# Altium project main_io.PrjPcb (part 4 of 6)

## Sheet RTC.SchDoc
size A4; Organization: Badgerloop; Address1: 133 Engineering Research; Address2: Building; Address3: Madison, WI 53715
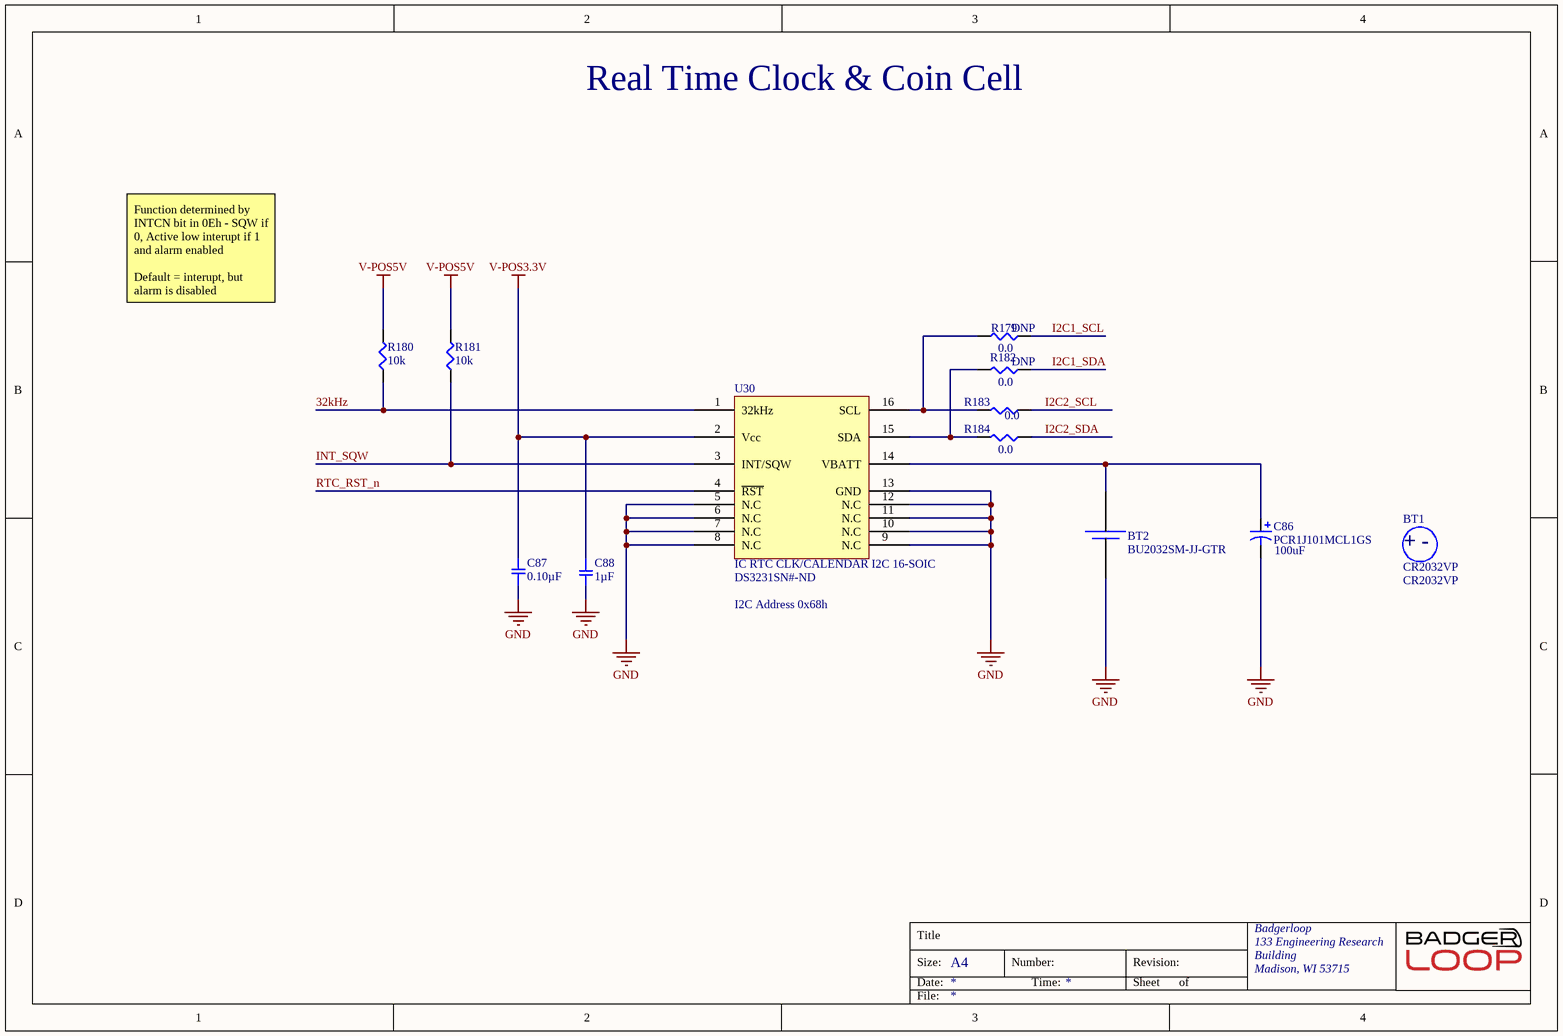
[diagram p11: RTC.SchDoc]

### Parts
BT1  CR2032VP  (mechanical)
BT2  BU2032SM-JJ-GTR  [BATTERY HOLDER COIN 20MM]
C86  PCR1J101MCL1GS  Capacitance: 100uF  [CAPAE110103X126M]
C87  0.10µF  [SMD-0805C]
C88  1µF  [SMD-0805C]
R179  0.0  [SMD-0805-RES]
R180  10k  [SMD-0805-RES]
R181  10k  [SMD-0805-RES]
R182  0.0  [SMD-0805-RES]
R183  0.0  [SMD-0805-RES]
R184  0.0  [SMD-0805-RES]
U30  IC RTC CLK/CALENDAR I2C 16-SOIC  Supplier Part Number 1: DS3231SN#-ND  [SOP127P1030X265-16N]

### Nets
GND: BT2.1(+) C86.2 C87.1 C88.2 U30.5(N.C) U30.6(N.C) U30.7(N.C) U30.8(N.C) U30.9(N.C) U30.10(N.C) U30.11(N.C) U30.12(N.C) U30.13(GND)
V-POS3.3V: C87.2 C88.1 U30.2(Vcc)
V-POS5V: R180.2 R181.2
32kHz: R180.1 U30.1(32kHz)
I2C1_SCL: R179.1
I2C1_SDA: R182.1
I2C2_SCL: R183.1
I2C2_SDA: R184.1
INT_SQW: R181.1 U30.3(INT/SQW)
RTC_RST_n: U30.4(~{RST})
NetBT2_2: BT2.2(-) C86.1 U30.14(VBATT)
NetR179_2: R179.2 R183.2 U30.16(SCL)
NetR182_2: R182.2 R184.2 U30.15(SDA)

### Notes on the sheet
- Real Time Clock & Coin Cell
- Function determined by INTCN bit in 0Eh - SQW if 0, Active low interupt if 1 and alarm enabled
  Default = interupt, but alarm is disabled
- I2C Address 0x68h
- Title
- Size:
- Date:
- A4
- Number:
- Time:
- Revision:
- Sheet
- of
- File:
- (in symbol CR2032VP) + -

### Library data of the parts
BT1 = CR2032VP: BATTERY LITHIUM 3V COIN 20MM; Manufacturer: Energizer; Capacity: 240mAh; Supplier 1: Newark; Stock 1: 0; Weight: 0.1oz; Voltage Rating: 3V; Package Quantity: 200; Height: 0.13inch; ComponentLink1URL: http://data.energizer.com/pdfs/cr2032.pdf?src-supplier=Digi-Key; ComponentLink1Description: http://data.energizer.com/pdfs/cr2032.pdf?src-supplier=Digi-Key; Supplier Part Number 1: 41P0336; Manufacturer Part Number: CR2032VP
BT2 = BU2032SM-JJ-GTR: HOLDER COIN CELL 2032 SMD; Manufacturer: Memory Protection Devices; Number of Cells: 1; Supplier 1: Digi-Key; Stock 1: 90564; Pricing 1: 1=0.99, 10=0.836, 100=0.6907 (USD); Mount: Surface Mount,PCB; Min Operating Temperature: -40°C; Max Operating Temperature: 280°C; Package Quantity: 400; Termination: SMD/SMT; ComponentLink1URL: http://www.memoryprotectiondevices.com/datasheets/BU2032SM-JJ-GTR-datasheet.pdf?src-supplier=Digi-Key; ComponentLink1Description: http://www.memoryprotectiondevices.com/datasheets/BU2032SM-JJ-GTR-datasheet.pdf?src-supplier=Digi-Key; ComponentLink2URL: https://media.digikey.com/pdf/Data%20Sheets/Memory%20Protection%20PDFs/Coin_Cell_Guide.pdf?src-supplier=Digi-Key; ComponentLink2Description: https://media.digikey.com/pdf/Data%20Sheets/Memory%20Protection%20PDFs/Coin_Cell_Guide.pdf?src-supplier=Digi-Key; Supplier Part Number 1: BU2032SM-JJ-GDKR-ND
C86 = PCR1J101MCL1GS: CAP ALUM POLY 100UF 20% 63V SMD; Manufacturer: Nichicon; ESR (Equivalent Series Resistance): 24mR; Ripple Current: 3A; Leakage Current: 3uA; Life (Hours): 4000Hour; Dissipation Factor: 0.08%; Supplier 1: Digi-Key; Manufacturer Part Number: PCR1J101MCL1GS; Stock 1: 11476; Pricing 1: 1=3.63000, 10=2.92800, 100=2.28380 (USD); RoHS: Yes; Mount: Surface Mount,PCB; Case/Package: Radial; Weight: 0.045856oz; Min Operating Temperature: -55°C; Max Operating Temperature: 125°C; Tolerance: 20%; Voltage Rating (DC): 63V; Package Quantity: 1; Packaging: Tape and Reel; Voltage Rating: 63V; Termination: SMD/SMT; Voltage: 63V; Diameter: 10mm; Length: 12.7mm; Height: 12.7mm; Height - Seated (Max): 0.504inch; Depth: 10.3mm; Lead Pitch: 4.6mm; Lead Free: Lead Free; ComponentLink1URL: https://datasheet.ciiva.com/29551/e-ch-ta-29551389.pdf?src-supplier=Digi-Key; ComponentLink1Description: https://datasheet.ciiva.com/29551/e-ch-ta-29551389.pdf?src-supplier=Digi-Key; ComponentLink2URL: https://datasheet.ciiva.com/29551/e-ch-ta-29551390.pdf?src-supplier=Digi-Key; ComponentLink2Description: https://datasheet.ciiva.com/29551/e-ch-ta-29551390.pdf?src-supplier=Digi-Key; ComponentLink3URL: https://datasheet.ciiva.com/29551/e-ch-ta-29551391.pdf?src-supplier=Digi-Key; ComponentLink3Description: https://datasheet.ciiva.com/29551/e-ch-ta-29551391.pdf?src-supplier=Digi-Key; Supplier Part Number 1: 493-13783-1-ND
C87 = GRM219R71C104JA01D: CAP CER 0.1UF 16V X7R 0805; Manufacturer: Murata Electronics North America; Factory Stock: 0; Unit Price (USD): 0.12; Minimum Quantity: 1; Tolerance: ±5%; Datasheets: -; Image: //media.digikey.com/Renders/Murata%20Renders/0805%20(2012%20Metric)%20.85mm.jpg; Digi-Key Part Number: 490-12557-1-ND; Part Number: GRM219R71C104JA01D; Quantity Available: 6635; @ qty: 0; Packaging: Cut Tape (CT); Series: GRM; Part Status: Active; Value: 0.10µF; Voltage: 16V; Temperature Coefficient: X7R; Operating Temperature: -55°C ~ 125°C; Features: -; Ratings: -; Applications: General Purpose; Mounting Type: Surface Mount, MLCC; Package / Case: 0805 (2012 Metric); Size / Dimension: 0.079" L x 0.049" W (2.00mm x 1.25mm); Height - Seated (Max): -; Thickness (Max): 0.037" (0.95mm); Lead Spacing: -; Lead Style: -
C88 = GRM21BR71H105KA12L: CAP CER 1UF 50V X7R 0805; Manufacturer: Murata Electronics North America; Factory Stock: 0; Unit Price (USD): 0.25; Minimum Quantity: 1; Tolerance: ±10%; Datasheets: http://www.murata.com/~/media/webrenewal/support/library/catalog/products/capacitor/mlcc/c02e.pdf; Image: //media.digikey.com/Renders/Murata%20Renders/0805%20(2012%20Metric)%20.85mm.jpg; Digi-Key Part Number: 490-4736-1-ND; Part Number: GRM21BR71H105KA12L; Quantity Available: 988032; @ qty: 0; Packaging: Cut Tape (CT); Series: GRM; Part Status: Active; Value: 1µF; Voltage: 50V; Temperature Coefficient: X7R; Operating Temperature: -55°C ~ 125°C; Features: -; Ratings: -; Applications: General Purpose; Mounting Type: Surface Mount, MLCC; Package / Case: 0805 (2012 Metric); Size / Dimension: 0.079" L x 0.049" W (2.00mm x 1.25mm); Height - Seated (Max): -; Thickness (Max): 0.053" (1.35mm); Lead Spacing: -; Lead Style: -
R179 R182-R184 = ERJ-6GEY0R00V: as R168 on sheet retros; Part Number: ERJ-6GEY0R00V; Datasheets: http://industrial.panasonic.com/www-cgi/jvcr13pz.cgi?E+PZ+3+AOA0001+ERJ6GEY0R00V+7+WW; Image: //media.digikey.com/Renders/Panasonic%20Renders/ERJ-0805%20Pkg.jpg; Digi-Key Part Number: P0.0ACT-ND; Quantity Available: 1597627; Packaging: Cut Tape (CT); Series: ERJ; Part Status: Active; Value: 0.0; Tolerance: Jumper; Composition: Thick Film; Features: Automotive AEC-Q200; Temperature Coefficient: -; Operating Temperature: -55°C ~ 155°C; Package / Case: 0805 (2012 Metric); Supplier Device Package: 0805; Size / Dimension: 0.079" L x 0.049" W (2.00mm x 1.25mm); Height - Seated (Max): 0.028" (0.70mm); Number of Terminations: 2; Failure Rate: -
  R179 R182: DNP: DNP
R180 R181 = ERJ-P06J103V: as R68 on sheet connectors; Part Number: ERJ-P06J103V; Datasheets: https://industrial.panasonic.com/cdbs/www-data/pdf/RDA0000/AOA0000C243.pdf; Image: //media.digikey.com/Renders/Panasonic%20Renders/ERJ-0805%20Pkg.jpg; Digi-Key Part Number: P10KADCT-ND; Quantity Available: 413576; Packaging: Cut Tape (CT); Series: ERJ; Part Status: Active; Value: 10k; Tolerance: ±5%; Composition: Thick Film; Features: Automotive AEC-Q200, Pulse Withstanding; Operating Temperature: -55°C ~ 155°C; Package / Case: 0805 (2012 Metric); Supplier Device Package: 0805; Size / Dimension: 0.079" L x 0.049" W (2.00mm x 1.25mm); Height - Seated (Max): 0.028" (0.70mm); Number of Terminations: 2; Failure Rate: -
U30 = DS3231: Manufacturer: Maxim; Manufacturer Part Number: DS3231SN#; Max Supply Voltage: 5.5V; Min Supply Voltage: 2.3V; Logic Function: Clock; Time Format: HH:MM:SS; Date Format: YY-MM-DD-dd; Operating Supply Voltage: 3.3V; Interface: I2C,Serial,2-Wire; Number of Outputs: 1; Frequency: 32.768kHz; Supplier 1: Digi-Key; Stock 1: 2824; Pricing 1: 1=9.61, 10=8.685, 25=8.2812, 100=7.1906, 250=6.8674, 500=6.26146, 1000=5.45353 (USD); Mount: Surface Mount; Case/Package: SOIC; Number of Pins: 16; Weight: 0.023492oz; Min Operating Temperature: -40°C; Max Operating Temperature: 85°C; Package Quantity: 46; Packaging: Bulk; Termination: SMD/SMT; Length: 10.5mm; Height: 2.35mm; Width: 7.6mm; Radiation Hardening: No; REACH SVHC: Unknown; Lead Free: Lead Free; ComponentLink1URL: https://datasheets.maximintegrated.com/en/ds/DS3231-DS3231S.pdf?src-supplier=Digi-Key; ComponentLink1Description: https://datasheets.maximintegrated.com/en/ds/DS3231-DS3231S.pdf?src-supplier=Digi-Key; ComponentLink2URL: http://datasheets.maxim-ic.com/en/ds/DS3231.pdf?src-supplier=Avnet+Europe; ComponentLink2Description: http://datasheets.maxim-ic.com/en/ds/DS3231.pdf?src-supplier=Avnet+Europe; ComponentLink3URL: http://www.farnell.com/datasheets/1675711.pdf?src-supplier=Element14; ComponentLink3Description: http://www.farnell.com/datasheets/1675711.pdf?src-supplier=Element14; ComponentLink4URL: http://www.mouser.com/ds/2/256/DS3231-102175.pdf?src-supplier=Mouser; ComponentLink4Description: http://www.mouser.com/ds/2/256/DS3231-102175.pdf?src-supplier=Mouser; ComponentLink5URL: http://datasheets.maximintegrated.com/en/ds/DS3231.pdf?src-supplier=Avnet; ComponentLink5Description: http://datasheets.maximintegrated.com/en/ds/DS3231.pdf?src-supplier=Avnet; ComponentLink6URL: http://datasheet.iiic.cc/maxim/DS3231SN_.pdf?src-supplier=IIIC; ComponentLink6Description: http://datasheet.iiic.cc/maxim/DS3231SN_.pdf?src-supplier=IIIC

## Sheet shutdown_circuit.SchDoc: Shutdown Circuit
size A4; Engineer: T.S, R.C, S.R, C.B; Organization: Badgerloop Electrical; Address1: 133 Engineering Research Building; Address2: 1500 Engineering Drive; Address3: Madison, Wi 53706
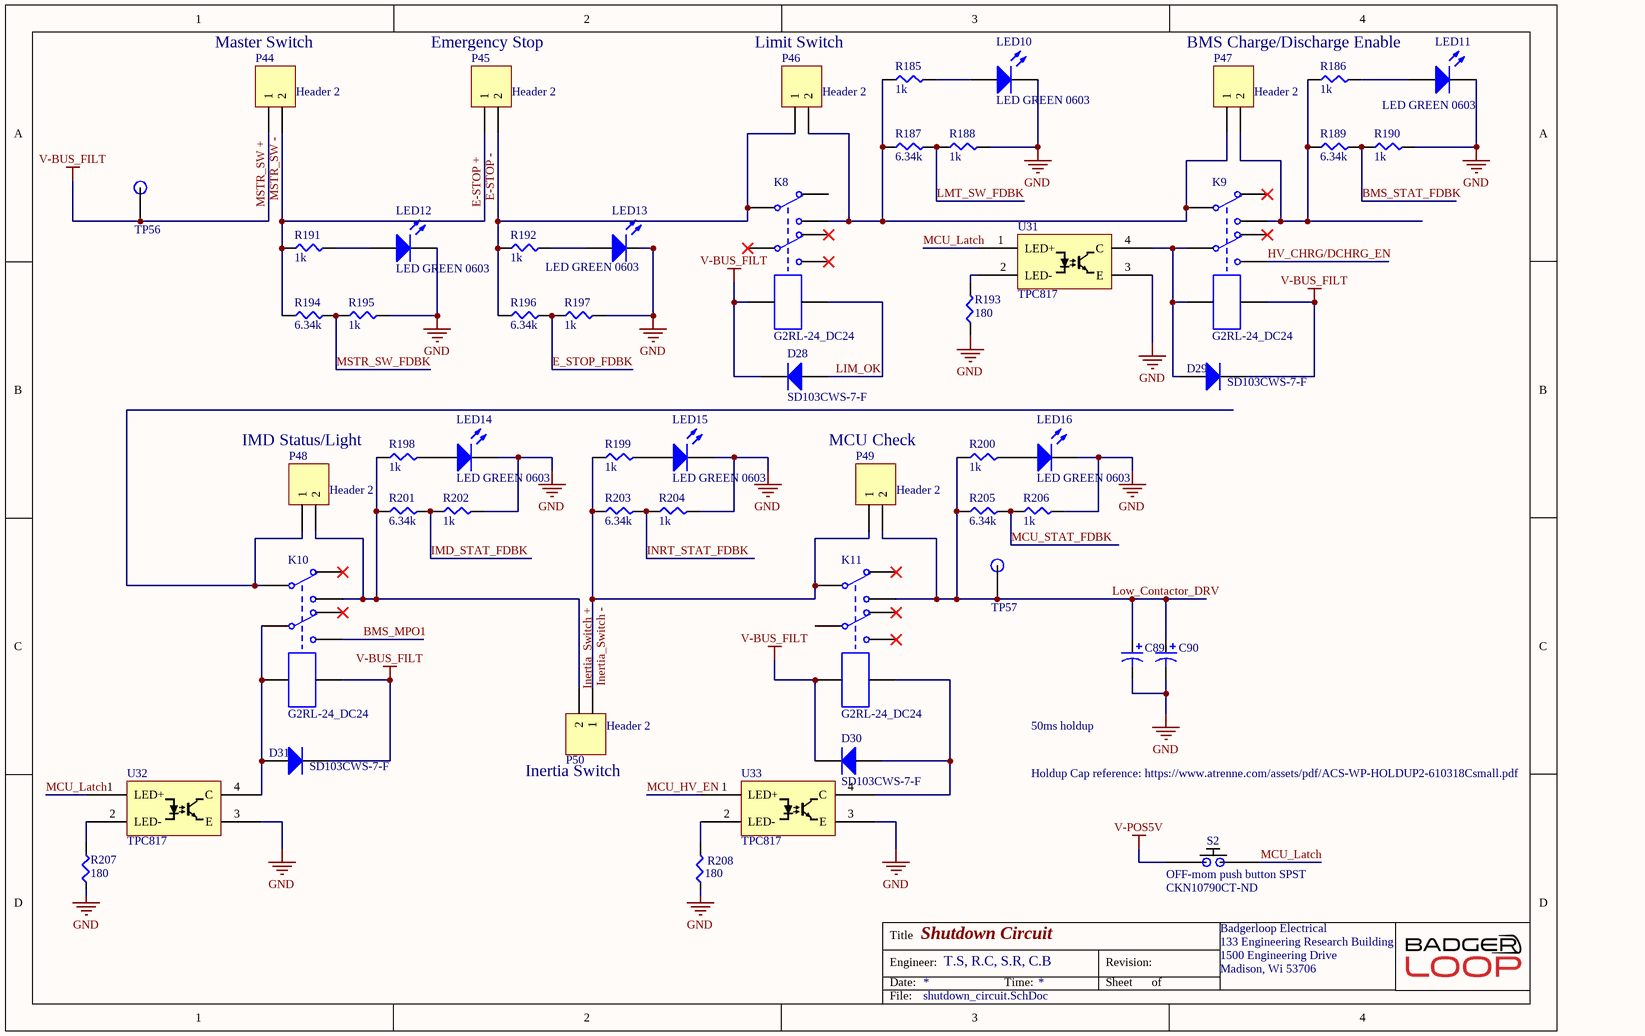
[diagram p12: shutdown_circuit.SchDoc]

### Parts
C89  PCR1J101MCL1GS  [CAPAE110103X126M]  (value not drawn)
C90  PCR1J101MCL1GS  [CAPAE110103X126M]  (value not drawn)
D28  Manufacturer P/N: SD103CWS-7-F  [SODFL250X110-2N]  (hidden comment: Diode General Purpose_2)
D29  Manufacturer P/N: SD103CWS-7-F  [SODFL250X110-2N]  (hidden comment: Diode General Purpose_2)
D30  Manufacturer P/N: SD103CWS-7-F  [SODFL250X110-2N]  (hidden comment: Diode General Purpose_2)
D31  Manufacturer P/N: SD103CWS-7-F  [SODFL250X110-2N]  (hidden comment: Diode General Purpose_2)
K8  G2RL-24_DC24  [G2RL]
K9  G2RL-24_DC24  [G2RL]
K10  G2RL-24_DC24  [G2RL]
K11  G2RL-24_DC24  [G2RL]
LED10  LED GREEN 0603  [LED 0603 GREEN]
LED11  LED GREEN 0603  [LED 0603 GREEN]
LED12  LED GREEN 0603  [LED 0603 GREEN]
LED13  LED GREEN 0603  [LED 0603 GREEN]
LED14  LED GREEN 0603  [LED 0603 GREEN]
LED15  LED GREEN 0603  [LED 0603 GREEN]
LED16  LED GREEN 0603  [LED 0603 GREEN]
P44  Header 2  [Pin Header 1x2 TH Pitch 2.54mm]
P45  Header 2  [Pin Header 1x2 TH Pitch 2.54mm]
P46  Header 2  [Pin Header 1x2 TH Pitch 2.54mm]
P47  Header 2  [Pin Header 1x2 TH Pitch 2.54mm]
P48  Header 2  [Pin Header 1x2 TH Pitch 2.54mm]
P49  Header 2  [Pin Header 1x2 TH Pitch 2.54mm]
P50  Header 2  [Pin Header 1x2 TH Pitch 2.54mm]
R185  1k  [SMD-0805-RES]
R186  1k  [SMD-0805-RES]
R187  6.34k  [SMD-0805-RES]
R188  1k  [SMD-0805-RES]
R189  6.34k  [SMD-0805-RES]
R190  1k  [SMD-0805-RES]
R191  1k  [SMD-0805-RES]
R192  1k  [SMD-0805-RES]
R193  180  [SMD-0805-RES]
R194  6.34k  [SMD-0805-RES]
R195  1k  [SMD-0805-RES]
R196  6.34k  [SMD-0805-RES]
R197  1k  [SMD-0805-RES]
R198  1k  [SMD-0805-RES]
R199  1k  [SMD-0805-RES]
R200  1k  [SMD-0805-RES]
R201  6.34k  [SMD-0805-RES]
R202  1k  [SMD-0805-RES]
R203  6.34k  [SMD-0805-RES]
R204  1k  [SMD-0805-RES]
R205  6.34k  [SMD-0805-RES]
R206  1k  [SMD-0805-RES]
R207  180  [SMD-0805-RES]
R208  180  [SMD-0805-RES]
S2  OFF-mom push button SPST  Supplier Part Number 1: CKN10790CT-ND  [K12SCS1.55NOLFTX]
TP56  TP  [Test Point]  (value not drawn)
TP57  TP  [Test Point]  (value not drawn)
U31  TPC817  [SOT200P1005X328-5N]
U32  TPC817  [SOT200P1005X328-5N]
U33  TPC817  [SOT200P1005X328-5N]

### Nets
GND: C89.2 C90.2 LED10.2(K) LED11.2(K) LED12.2(K) LED13.2(K) LED14.2(K) LED15.2(K) LED16.2(K) R188.2 R190.2 R193.1 R195.2 R197.2 R202.2 R204.2 R206.2 R207.1 R208.1 U31.3(E) U32.3(E) U33.3(E)
MSTR_SW +: D28.2(K) D29.2(K) D30.2(K) D31.2(K) K8.1 K9.8 K10.8 K11.1 P44.1 TP56.1  [also labelled V-BUS_FILT]
V-POS5V: S2.1
BMS_MPO1: K10.7
BMS_STAT_FDBK: R189.2 R190.1
E-STOP +: P44.2 P45.1 R191.1 R194.1  [also labelled MSTR_SW -]
E-STOP -: K8.3 P45.2 P46.1 R192.1 R196.1
E_STOP_FDBK: R196.2 R197.1
HV_CHRG/DCHRG_EN: K9.7
IMD_STAT_FDBK: R201.2 R202.1
Inertia_Switch +: K10.4 P48.2 P50.2 R198.1 R201.1
Inertia_Switch -: K11.3 P49.1 P50.1 R199.1 R203.1
INRT_STAT_FDBK: R203.2 R204.1
LIM_OK: D28.1(A) K8.8
LMT_SW_FDBK: R187.2 R188.1
Low_Contactor_DRV: C89.1 C90.1 K11.4 P49.2 R200.1 R205.1 TP57.1
MCU_HV_EN: U33.1(LED+)
MCU_Latch: S2.2 U31.1(LED+) U32.1(LED+)
MCU_STAT_FDBK: R205.2 R206.1
MSTR_SW_FDBK: R194.2 R195.1
NetD29_1: D29.1(A) K9.1 K9.6 U31.4(C)
NetD30_1: D30.1(A) K11.8 U33.4(C)
NetD31_1: D31.1(A) K10.1 K10.6 U32.4(C)
NetK8_4: K8.4 K9.3 P46.2 P47.1 R185.1 R187.1
NetK9_4: K9.4 P47.2 R186.1 R189.1
NetK10_3: K10.3 P48.1
NetLED10_1: LED10.1(A) R185.2
NetLED11_1: LED11.1(A) R186.2
NetLED12_1: LED12.1(A) R191.2
NetLED13_1: LED13.1(A) R192.2
NetLED14_1: LED14.1(A) R198.2
NetLED15_1: LED15.1(A) R199.2
NetLED16_1: LED16.1(A) R200.2
NetR193_2: R193.2 U31.2(LED-)
NetR207_2: R207.2 U32.2(LED-)
NetR208_2: R208.2 U33.2(LED-)

Not connected (* = marked no-connect by the designer): K8 2 5* 6* 7*; K9 2* 5*; K10 2* 5*; K11 2* 5* 6 7*

### Notes on the sheet
- Master Switch
- Emergency Stop
- Limit Switch
- BMS Charge/Discharge Enable
- (near R198) IMD Status/Light
- MCU Check
- (near P50) Inertia Switch
- 50ms holdup
- Holdup Cap reference: https://www.atrenne.com/assets/pdf/ACS-WP-HOLDUP2-610318Csmall.pdf
- Title
- Engineer:
- Date:
- Time:
- Revision:
- Sheet
- of
- File:

### Library data of the parts
C89 C90 = PCR1J101MCL1GS: as C86 on sheet RTC; Supplier 1: Digi-Key; Manufacturer Part Number: PCR1J101MCL1GS; Stock 1: 11476; Pricing 1: 1=3.63000, 10=2.92800, 100=2.28380 (USD); RoHS: Yes; Mount: Surface Mount,PCB; Case/Package: Radial; Weight: 0.045856oz; Min Operating Temperature: -55°C; Max Operating Temperature: 125°C; Capacitance: 100uF; Tolerance: 20%; Voltage Rating (DC): 63V; Package Quantity: 1; Packaging: Tape and Reel; Voltage Rating: 63V; Termination: SMD/SMT; Voltage: 63V; Diameter: 10mm; Length: 12.7mm; Height: 12.7mm; Height - Seated (Max): 0.504inch; Depth: 10.3mm; Lead Pitch: 4.6mm; Lead Free: Lead Free; ComponentLink1URL: https://datasheet.ciiva.com/29551/e-ch-ta-29551389.pdf?src-supplier=Digi-Key; ComponentLink1Description: https://datasheet.ciiva.com/29551/e-ch-ta-29551389.pdf?src-supplier=Digi-Key; ComponentLink2URL: https://datasheet.ciiva.com/29551/e-ch-ta-29551390.pdf?src-supplier=Digi-Key; ComponentLink2Description: https://datasheet.ciiva.com/29551/e-ch-ta-29551390.pdf?src-supplier=Digi-Key; ComponentLink3URL: https://datasheet.ciiva.com/29551/e-ch-ta-29551391.pdf?src-supplier=Digi-Key; ComponentLink3Description: https://datasheet.ciiva.com/29551/e-ch-ta-29551391.pdf?src-supplier=Digi-Key; Supplier Part Number 1: 493-13783-1-ND
D28-D31 = Diode General Purpose_2: DIODE GEN PURP 20V 350MA SOD323; Manufacturer: Diodes Incorporated; Digikey P/N: SD103CWS-FDIDKR-ND; Package / Case: SOD323; Do Not Populate: *; ComponentLink1Description: Digikey; ComponentLink1URL: https://www.digikey.com/product-detail/en/diodes-incorporated/SD103CWS-7-F/SD103CWS-FDIDKR-ND/1836772; ComponentLink2Description: Datasheet; ComponentLink2URL: https://www.diodes.com/assets/Datasheets/ds30101.pdf; ComponentLink3Description: Dimensions; ComponentLink3URL: https://www.diodes.com/assets/Package-Files/SOD323.pdf
K8-K11 = G2RL-24_DC24: RELAY GEN PURPOSE DPDT 8A 24V; Manufacturer: Omron; Manufacturer Part Number: G2RL-24-DC24; Voltage Rating (AC): 440V; Voltage Rating (DC): 300V; Power Consumption: 400mW; Coil Resistance: 1.44kR; Coil Current: 16.7mA; Operate Time: 15ms; Coil Type: Non-Latching; Relay Type: General Purpose; Release Time: 5ms; Supplier 1: Digi-Key; Stock 1: 13387; Pricing 1: 1=4.32, 10=4.053, 25=3.6028, 50=3.4226, 100=3.2425, 250=2.88224, 500=2.7021 (USD); Mount: Through Hole; Case/Package: DIP; Number of Pins: 8; Weight: 12g; Contact Material: Silver,Cadmium; Min Operating Temperature: -40°C; Max Operating Temperature: 85°C; Max Current Rating: 8A; Packaging: Bulk; Max Voltage Rating (AC): 440V; Max Voltage Rating (DC): 300V; Package Quantity: 20; Throw Configuration: DPDT; Termination: PC Pin; Contact Current Rating: 8A; Coil Voltage (DC): 24V; Coil Power: 400mW; Power Rating: 400mW; Length: 29mm; Height: 15.7mm; Width: 12.7mm; Depth: 12.7mm; Radiation Hardening: No; Lead Free: Lead Free; ComponentLink1URL: http://www.alliedelec.com/images/products/datasheets/bm/OMRON_ELECTRONICS_LLC/70175264.pdf?src-supplier=Allied+Electronics; ComponentLink1Description: http://www.alliedelec.com/images/products/datasheets/bm/OMRON_ELECTRONICS_LLC/70175264.pdf?src-supplier=Allied+Electronics; ComponentLink2URL: http://www.mouser.com/ds/2/307/en-g2rl-472571.pdf?src-supplier=Mouser; ComponentLink2Description: http://www.mouser.com/ds/2/307/en-g2rl-472571.pdf?src-supplier=Mouser
LED10-LED16 = LED GREEN 0603: Manufacturer: Lite-On Inc.; Manufacturer P/N: LTST-C190KGKT; Digikey P/N: 160-1435-1-ND; Package / Case: 0603; Color: GREEN
P44-P50 = Header 2: Header, 2-Pin; LatestRevisionDate: 17-Jul-2002; LatestRevisionNote: Re-released for DXP Platform.; Publisher: Altium Limited
R185 R186 R188 R190-R192 R195 R197-R200 R202 R204 R206 = ERJ-P06F1001V: RES SMD 1K OHM 1% 1/2W 0805; Manufacturer: Panasonic Electronic Components; Factory Stock: 0; Unit Price (USD): 0.02534; @ qty: 1500; Minimum Quantity: 1; Power (Watts): 0.5W, 1/2W; Temperature Coefficient: ±100ppm/°C; Part Number: ERJ-P06F1001V; Datasheets: https://industrial.panasonic.com/cdbs/www-data/pdf/RDA0000/AOA0000C243.pdf; Image: //media.digikey.com/Renders/Panasonic%20Renders/ERJ-0805%20Pkg.jpg; Digi-Key Part Number: P16058CT-ND; Quantity Available: 161264; Packaging: Cut Tape (CT); Series: ERJ; Part Status: Active; Value: 1k; Tolerance: ±1%; Composition: Thick Film; Features: Automotive AEC-Q200, Pulse Withstanding; Operating Temperature: -55°C ~ 155°C; Package / Case: 0805 (2012 Metric); Supplier Device Package: 0805; Size / Dimension: 0.079" L x 0.049" W (2.00mm x 1.25mm); Height - Seated (Max): 0.028" (0.70mm); Number of Terminations: 2; Failure Rate: -
R187 R189 R194 R196 R201 R203 R205 = ERJ-6ENF6341V: RES SMD 6.34K OHM 1% 1/8W 0805; Manufacturer: Panasonic Electronic Components; Factory Stock: 0; Unit Price (USD): 0.00729; @ qty: 1500; Minimum Quantity: 1; Power (Watts): 0.125W, 1/8W; Temperature Coefficient: ±100ppm/°C; Part Number: ERJ-6ENF6341V; Datasheets: http://industrial.panasonic.com/www-cgi/jvcr13pz.cgi?E+PZ+3+AOA0002+ERJ6ENF6341V+7+WW; Image: //media.digikey.com/Renders/Panasonic%20Renders/ERJ-0805%20Pkg.jpg; Digi-Key Part Number: P6.34KCCT-ND; Quantity Available: 19605; Packaging: Cut Tape (CT); Series: ERJ; Part Status: Active; Value: 6.34k; Tolerance: ±1%; Composition: Thick Film; Features: Automotive AEC-Q200; Operating Temperature: -55°C ~ 155°C; Package / Case: 0805 (2012 Metric); Supplier Device Package: 0805; Size / Dimension: 0.079" L x 0.049" W (2.00mm x 1.25mm); Height - Seated (Max): 0.028" (0.70mm); Number of Terminations: 2; Failure Rate: -
R193 R207 R208 = ERJ-6ENF1800V: RES SMD 180 OHM 1% 1/8W 0805; Manufacturer: Panasonic Electronic Components; Factory Stock: 0; Unit Price (USD): 0.00729; @ qty: 1500; Minimum Quantity: 1; Power (Watts): 0.125W, 1/8W; Temperature Coefficient: ±100ppm/°C; Part Number: ERJ-6ENF1800V; Datasheets: http://industrial.panasonic.com/www-cgi/jvcr13pz.cgi?E+PZ+3+AOA0002+ERJ6ENF1800V+7+WW; Image: //media.digikey.com/Renders/Panasonic%20Renders/ERJ-0805%20Pkg.jpg; Digi-Key Part Number: P180CCT-ND; Quantity Available: 33231; Packaging: Cut Tape (CT); Series: ERJ; Part Status: Active; Value: 180; Tolerance: ±1%; Composition: Thick Film; Features: Automotive AEC-Q200; Operating Temperature: -55°C ~ 155°C; Package / Case: 0805 (2012 Metric); Supplier Device Package: 0805; Size / Dimension: 0.079" L x 0.049" W (2.00mm x 1.25mm); Height - Seated (Max): 0.028" (0.70mm); Number of Terminations: 2; Failure Rate: -
S2 = K12SCS1.55NOLFTX: OFF-mom push button SPST K12SCS1.55NOLFTX; Manufacturer: ITT C&K; Mechanical Life: 200000Cycles; Current Rating: 100mA; Voltage Rating (DC): 30V; Actuator Type: Round, Button; Ratings: IP40; Supplier 1: Digi-Key; Manufacturer Part Number: K12SCS1.55NOLFTX; Stock 1: 4036; Pricing 1: 1=2.33, 10=2.175, 25=2.0716, 50=1.968, 100=1.9162, 250=1.86436 (USD); Mount: Surface Mount; Min Operating Temperature: -40°C; Max Operating Temperature: 85°C; Throw Configuration: SPST; Packaging: Cut Tape; Switch Function: Off-Mom; Termination: SMD/SMT; Electrical Life: 200000Cycles; ComponentLink1URL: https://www.ckswitches.com/media/1338/k12s.pdf?src-supplier=Digi-Key; ComponentLink1Description: https://www.ckswitches.com/media/1338/k12s.pdf?src-supplier=Digi-Key; ComponentLink2Description: https://www.digikey.com/product-detail/en/c-k/K12SCS1.55NOLFTX/CKN10790CT-ND/7056072; ComponentLink2URL: https://www.digikey.com/product-detail/en/c-k/K12SCS1.55NOLFTX/CKN10790CT-ND/7056072
TP56 TP57 = TP: SMD TEST POINT
U31-U33 = TPC817: OPTOISO 5KV TRANS 4SOP; Manufacturer: Taiwan Semi; Manufacturer P/N: TPC817S1B RAG; Digikey Link: https://www.digikey.com/product-detail/en/taiwan-semiconductor-corporation/TPC817S1B-RAG/TPC817S1BRAGCT-ND/7359679; Digikey P/N: TPC817S1BRAGCT-ND

## Sheet adc.SchDoc
size A4; Organization: Badgerloop; Address1: 133 Engineering Research; Address2: Building; Address3: Madison, WI 53715
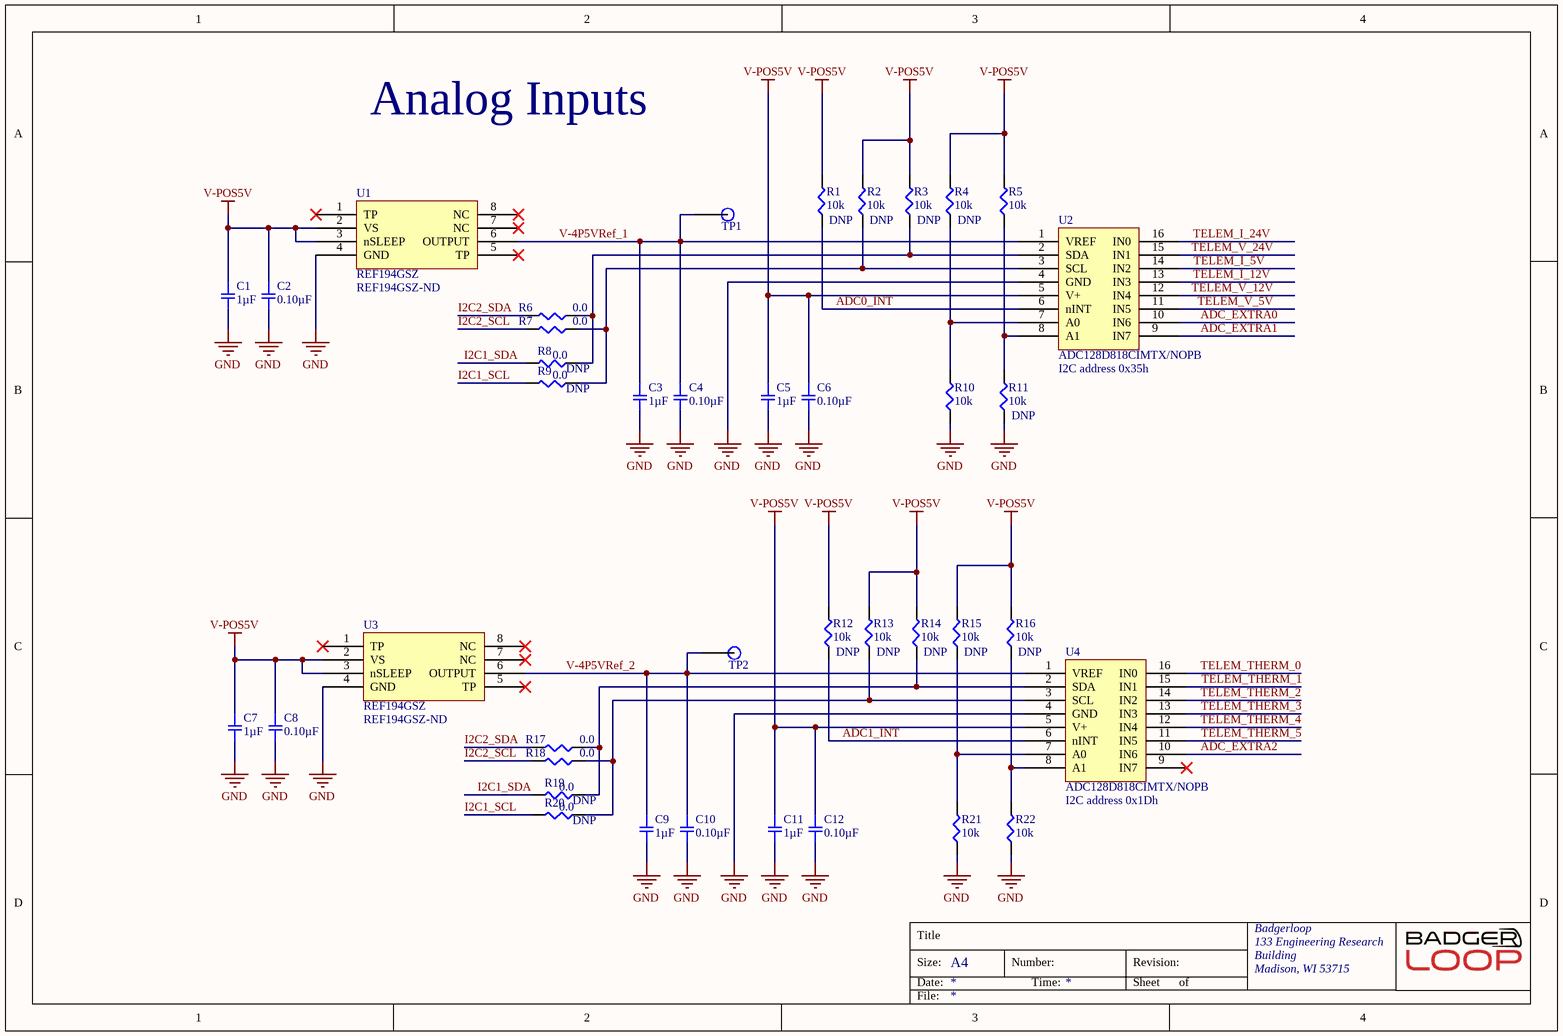
[diagram p13: adc.SchDoc]

### Parts
C1  1µF  [SMD-0805C]
C2  0.10µF  [SMD-0805C]
C3  1µF  [SMD-0805C]
C4  0.10µF  [SMD-0805C]
C5  1µF  [SMD-0805C]
C6  0.10µF  [SMD-0805C]
C7  1µF  [SMD-0805C]
C8  0.10µF  [SMD-0805C]
C9  1µF  [SMD-0805C]
C10  0.10µF  [SMD-0805C]
C11  1µF  [SMD-0805C]
C12  0.10µF  [SMD-0805C]
R1  10k  [SMD-0805-RES]
R2  10k  [SMD-0805-RES]
R3  10k  [SMD-0805-RES]
R4  10k  [SMD-0805-RES]
R5  10k  [SMD-0805-RES]
R6  0.0  [SMD-0805-RES]
R7  0.0  [SMD-0805-RES]
R8  0.0  [SMD-0805-RES]
R9  0.0  [SMD-0805-RES]
R10  10k  [SMD-0805-RES]
R11  10k  [SMD-0805-RES]
R12  10k  [SMD-0805-RES]
R13  10k  [SMD-0805-RES]
R14  10k  [SMD-0805-RES]
R15  10k  [SMD-0805-RES]
R16  10k  [SMD-0805-RES]
R17  0.0  [SMD-0805-RES]
R18  0.0  [SMD-0805-RES]
R19  0.0  [SMD-0805-RES]
R20  0.0  [SMD-0805-RES]
R21  10k  [SMD-0805-RES]
R22  10k  [SMD-0805-RES]
TP1  TP  [Test Point]  (value not drawn)
TP2  TP  [Test Point]  (value not drawn)
U1  REF194GSZ  Supplier Part Number 1: REF194GSZ-ND  [SOP127P600X175-8N]
U2  ADC128D818CIMTX/NOPB  [TSOP65P660X120-16N]
U3  REF194GSZ  Supplier Part Number 1: REF194GSZ-ND  [SOP127P600X175-8N]
U4  ADC128D818CIMTX/NOPB  [TSOP65P660X120-16N]

### Nets
GND: C1.2 C2.2 C3.2 C4.2 C5.2 C6.2 C7.2 C8.2 C9.2 C10.2 C11.2 C12.2 R10.1 R11.1 R21.1 R22.1 U1.4(GND) U2.4(GND) U3.4(GND) U4.4(GND)
V-POS5V: C1.1 C2.1 C5.1 C6.1 C7.1 C8.1 C11.1 C12.1 R1.2 R2.2 R3.2 R4.2 R5.2 R12.2 R13.2 R14.2 R15.2 R16.2 U1.2(VS) U1.3(nSLEEP) U2.5(V+) U3.2(VS) U3.3(nSLEEP) U4.5(V+)
ADC0_INT: R1.1 U2.6(nINT)
ADC1_INT: R12.1 U4.6(nINT)
ADC_EXTRA0: U2.10(IN6)
ADC_EXTRA1: U2.9(IN7)
ADC_EXTRA2: U4.10(IN6)
I2C1_SCL: R9.2 R20.2
I2C1_SDA: R8.2 R19.2
I2C2_SCL: R7.2 R18.2
I2C2_SDA: R6.2 R17.2
TELEM_I_5V: U2.14(IN2)
TELEM_I_12V: U2.13(IN3)
TELEM_I_24V: U2.16(IN0)
TELEM_THERM_0: U4.16(IN0)
TELEM_THERM_1: U4.15(IN1)
TELEM_THERM_2: U4.14(IN2)
TELEM_THERM_3: U4.13(IN3)
TELEM_THERM_4: U4.12(IN4)
TELEM_THERM_5: U4.11(IN5)
TELEM_V_5V: U2.11(IN5)
TELEM_V_12V: U2.12(IN4)
TELEM_V_24V: U2.15(IN1)
V-4P5VRef_1: C3.1 C4.1 TP1.1 U1.6(OUTPUT) U2.1(VREF)
V-4P5VRef_2: C9.1 C10.1 TP2.1 U3.6(OUTPUT) U4.1(VREF)
NetR2_1: R2.1 R7.1 R9.1 U2.3(SCL)
NetR3_1: R3.1 R6.1 R8.1 U2.2(SDA)
NetR4_1: R4.1 R10.2 U2.7(A0)
NetR5_1: R5.1 R11.2 U2.8(A1)
NetR13_1: R13.1 R18.1 R20.1 U4.3(SCL)
NetR14_1: R14.1 R17.1 R19.1 U4.2(SDA)
NetR15_1: R15.1 R21.2 U4.7(A0)
NetR16_1: R16.1 R22.2 U4.8(A1)

Not connected (* = marked no-connect by the designer): U1 1(TP)* 5(TP)* 7(NC)* 8(NC)*; U3 1(TP)* 5(TP)* 7(NC)* 8(NC)*; U4 9(IN7)*

### Notes on the sheet
- Analog Inputs
- (near U2) I2C address 0x35h
- (near U4) I2C address 0x1Dh
- Title
- Size:
- Date:
- A4
- Number:
- Time:
- Revision:
- Sheet
- of
- File:

### Library data of the parts
C1 C3 C5 C7 C9 C11 = GRM21BR71H105KA12L: CAP CER 1UF 50V X7R 0805; Manufacturer: Murata Electronics North America; Factory Stock: 0; Unit Price (USD): 0.25; Minimum Quantity: 1; Tolerance: ±10%; Datasheets: http://www.murata.com/~/media/webrenewal/support/library/catalog/products/capacitor/mlcc/c02e.pdf; Image: //media.digikey.com/Renders/Murata%20Renders/0805%20(2012%20Metric)%20.85mm.jpg; Digi-Key Part Number: 490-4736-1-ND; Part Number: GRM21BR71H105KA12L; Quantity Available: 988032; @ qty: 0; Packaging: Cut Tape (CT); Series: GRM; Part Status: Active; Value: 1µF; Voltage: 50V; Temperature Coefficient: X7R; Operating Temperature: -55°C ~ 125°C; Features: -; Ratings: -; Applications: General Purpose; Mounting Type: Surface Mount, MLCC; Package / Case: 0805 (2012 Metric); Size / Dimension: 0.079" L x 0.049" W (2.00mm x 1.25mm); Height - Seated (Max): -; Thickness (Max): 0.053" (1.35mm); Lead Spacing: -; Lead Style: -
C2 C4 C6 C8 C10 C12 = GCD21BR71H104KA01L: CAP CER 0.1UF 50V X7R 0805; Manufacturer: Murata Electronics North America; Factory Stock: 0; Unit Price (USD): 0.24; Minimum Quantity: 1; Tolerance: ±10%; Datasheets: http://www.murata.com/~/media/webrenewal/support/library/catalog/products/capacitor/mlcc/c03e.ashx; Image: //media.digikey.com/Renders/Murata%20Renders/0805%28GxM6%29.jpg; Digi-Key Part Number: 490-11955-1-ND; Part Number: GCD21BR71H104KA01L; Quantity Available: 157; @ qty: 0; Packaging: Cut Tape (CT); Series: GCD; Part Status: Active; Value: 0.10µF; Voltage: 50V; Temperature Coefficient: X7R; Operating Temperature: -55°C ~ 125°C; Features: -; Ratings: AEC-Q200; Applications: Automotive; Mounting Type: Surface Mount, MLCC; Package / Case: 0805 (2012 Metric); Size / Dimension: 0.079" L x 0.049" W (2.00mm x 1.25mm); Height - Seated (Max): -; Thickness (Max): 0.049" (1.25mm); Lead Spacing: -; Lead Style: -
R1-R5 R10-R16 R21 R22 = ERJ-P06J103V: RES SMD 10K OHM 5% 1/2W 0805; Manufacturer: Panasonic Electronic Components; Factory Stock: 0; Unit Price (USD): 0.01839; @ qty: 1500; Minimum Quantity: 1; Power (Watts): 0.5W, 1/2W; Temperature Coefficient: ±200ppm/°C; Part Number: ERJ-P06J103V; Datasheets: https://industrial.panasonic.com/cdbs/www-data/pdf/RDA0000/AOA0000C243.pdf; Image: //media.digikey.com/Renders/Panasonic%20Renders/ERJ-0805%20Pkg.jpg; Digi-Key Part Number: P10KADCT-ND; Quantity Available: 413576; Packaging: Cut Tape (CT); Series: ERJ; Part Status: Active; Value: 10k; Tolerance: ±5%; Composition: Thick Film; Features: Automotive AEC-Q200, Pulse Withstanding; Operating Temperature: -55°C ~ 155°C; Package / Case: 0805 (2012 Metric); Supplier Device Package: 0805; Size / Dimension: 0.079" L x 0.049" W (2.00mm x 1.25mm); Height - Seated (Max): 0.028" (0.70mm); Number of Terminations: 2; Failure Rate: -
  R1-R4 R11-R16: DNP: DNP
R6-R9 R17-R20 = ERJ-6GEY0R00V: RES SMD 0.0 OHM JUMPER 1/8W 0805; Manufacturer: Panasonic Electronic Components; Factory Stock: 0; Unit Price (USD): 0.00544; @ qty: 1500; Minimum Quantity: 1; Power (Watts): 0.125W, 1/8W; Part Number: ERJ-6GEY0R00V; Datasheets: http://industrial.panasonic.com/www-cgi/jvcr13pz.cgi?E+PZ+3+AOA0001+ERJ6GEY0R00V+7+WW; Image: //media.digikey.com/Renders/Panasonic%20Renders/ERJ-0805%20Pkg.jpg; Digi-Key Part Number: P0.0ACT-ND; Quantity Available: 1597627; Packaging: Cut Tape (CT); Series: ERJ; Part Status: Active; Value: 0.0; Tolerance: Jumper; Composition: Thick Film; Features: Automotive AEC-Q200; Temperature Coefficient: -; Operating Temperature: -55°C ~ 155°C; Package / Case: 0805 (2012 Metric); Supplier Device Package: 0805; Size / Dimension: 0.079" L x 0.049" W (2.00mm x 1.25mm); Height - Seated (Max): 0.028" (0.70mm); Number of Terminations: 2; Failure Rate: -
  R8 R9 R19 R20: DNP: DNP
TP1 TP2 = TP: SMD TEST POINT
U1 U3 = REF194GSZ: IC VREF SERIES 4.5V 8SOIC; Manufacturer: Analog Devices; Max Input Voltage: 18V; Max Output Current: 30mA; Temperature Coefficient: 25ppm/°C; Number of Channels: 1; Min Output Voltage: 4.49V; Operating Supply Current: 45uA; Quiescent Current: 15uA; Min Input Voltage: 4.75V; Supplier 1: Digi-Key; Manufacturer Part Number: REF194GSZ; Stock 1: 359; Pricing 1: 1=3.56000, 10=3.19700, 25=3.02240, 100=2.61940, 250=2.48512, 500=2.22988, 1000=1.88062, 2500=1.78659 (USD); RoHS: Yes; Case/Package: R; Number of Pins: 8; Min Operating Temperature: -40°C; Max Operating Temperature: 85°C; Output Voltage: 4.5V; Packaging: Rail/Tube; Output Current: 30mA; Max Output Voltage: 4.5V; Reference Type: Series; Package Quantity: 98; Nominal Supply Current: 45uA; Reference Voltage: 4.5V; Length: 5mm; Height: 1.5mm; Width: 4mm; Radiation Hardening: No; Lead Free: Contains Lead; REACH SVHC: No SVHC; ComponentLink1URL: https://datasheet.ciiva.com/17219/ref19xseries-17219157.pdf?src-supplier=Avnet+Europe; ComponentLink1Description: https://datasheet.ciiva.com/17219/ref19xseries-17219157.pdf?src-supplier=Avnet+Europe; ComponentLink2URL: https://datasheet.ciiva.com/22666/1506113-22666153.pdf?src-supplier=Element14; ComponentLink2Description: https://datasheet.ciiva.com/22666/1506113-22666153.pdf?src-supplier=Element14; ComponentLink3URL: https://datasheet.ciiva.com/2005/ref19xseries-2005902.pdf?src-supplier=Digi-Key; ComponentLink3Description: https://datasheet.ciiva.com/2005/ref19xseries-2005902.pdf?src-supplier=Digi-Key; ComponentLink4URL: https://datasheet.ciiva.com/3235/ref19xseries-3235518.pdf?src-supplier=Avnet; ComponentLink4Description: https://datasheet.ciiva.com/3235/ref19xseries-3235518.pdf?src-supplier=Avnet
U2 U4 = ADC128D818CIMTX/NOPB: Analog to Digital Converters - ADC; Manufacturer: TI National Semiconductor; Resolution: 12b; Sampling Rate: 10000S/s; Number of A/D Converters: 1; Polarity: Unipolar; Max Supply Voltage: 5.5V; Min Supply Voltage: 3V; Interface: I2C; Number of Channels: 8; Max Power Dissipation: 33mW; Number of Converters: 4; Number of Bits: 12; Integral Nonlinearity (INL): -2LSB; Supply Type: Analog,Digital,Single; Power Consumption: 2mW; Power Dissipation: 2.01mW; Differential Nonlinearity: 1LSB; Supplier 1: Digi-Key; Manufacturer Part Number: ADC128D818CIMTX/NOPB; Stock 1: 21177; Pricing 1: 1=4.68000, 10=4.20700, 100=3.44660, 500=2.93402, 1000=2.47447 (USD); RoHS: Yes; Mount: Surface Mount; Case/Package: TSSOP; Number of Pins: 16; Contact Plating: Tin,Matte; Min Operating Temperature: -40°C; Max Operating Temperature: 125°C; Packaging: Tape and Reel; Package Quantity: 2500; Number of Inputs: 8; Number of Elements: 1; Radiation Hardening: No; Lead Free: Lead Free; ComponentLink1URL: https://datasheet.ciiva.com/14259/adc128d818-14259977.pdf?src-supplier=Avnet; ComponentLink1Description: https://datasheet.ciiva.com/14259/adc128d818-14259977.pdf?src-supplier=Avnet; Supplier Part Number 1: 296-41182-1-ND

## Sheet battery_interface.SchDoc
size A4; Organization: Badgerloop; Address1: 133 Engineering Research; Address2: Building; Address3: Madison, WI 53715
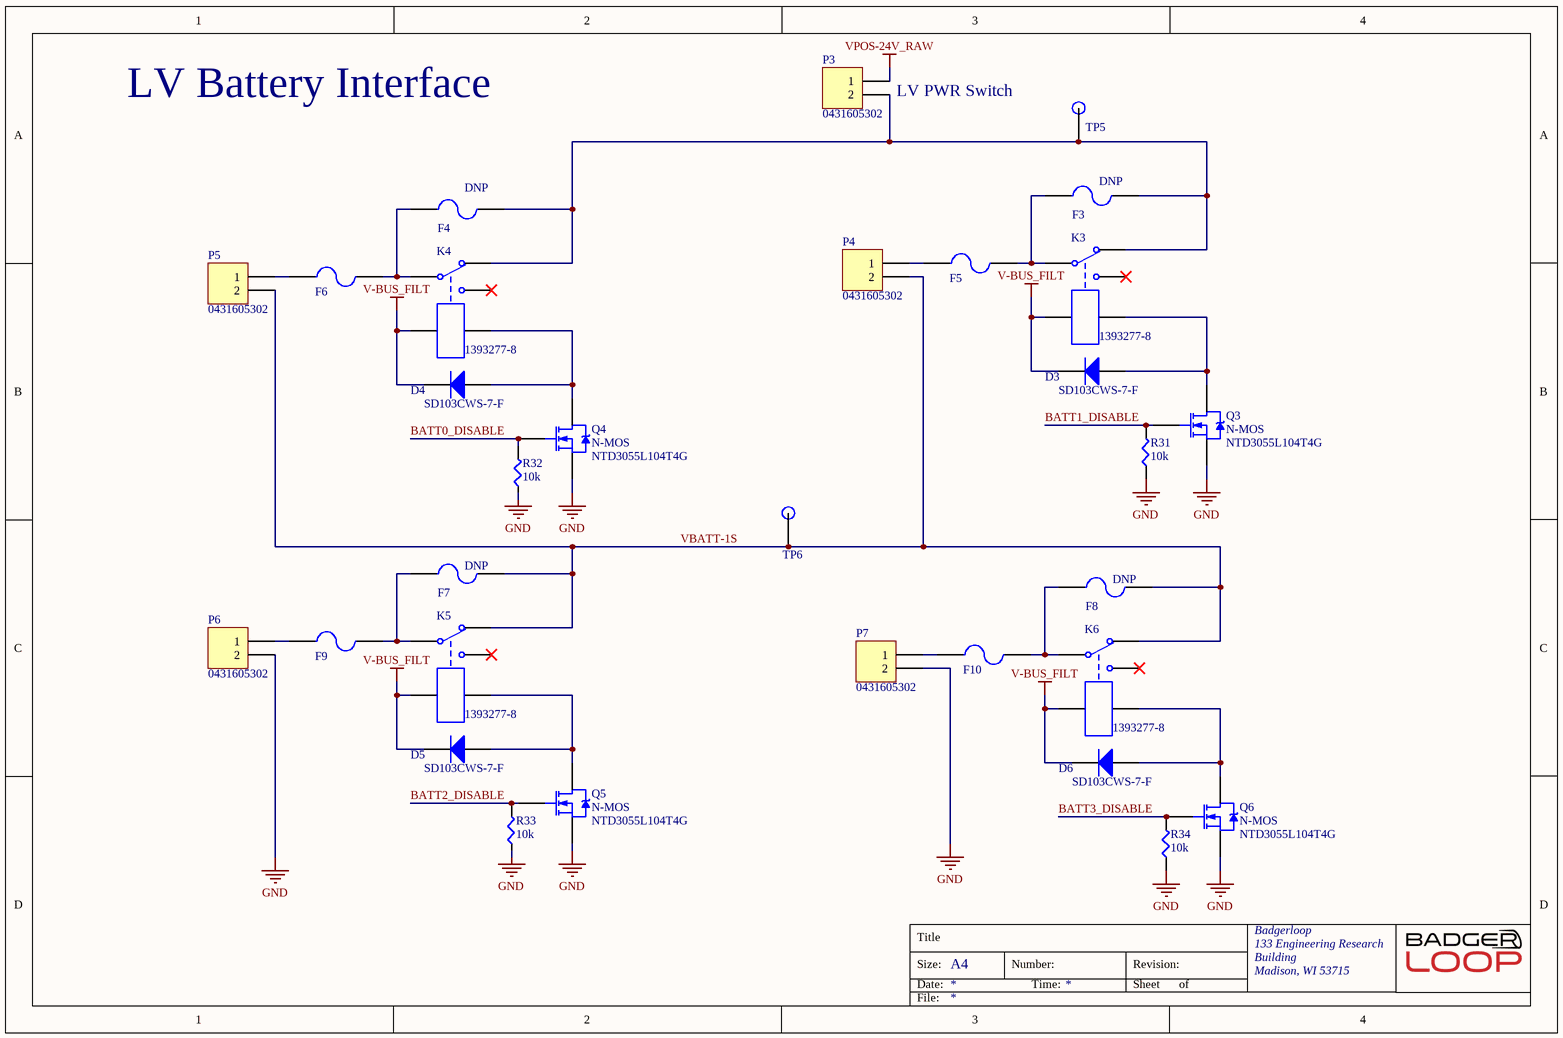
[diagram p14: battery_interface.SchDoc]

### Parts
D3  Manufacturer P/N: SD103CWS-7-F  [SODFL250X110-2N]  (hidden comment: Diode General Purpose_2)
D4  Manufacturer P/N: SD103CWS-7-F  [SODFL250X110-2N]  (hidden comment: Diode General Purpose_2)
D5  Manufacturer P/N: SD103CWS-7-F  [SODFL250X110-2N]  (hidden comment: Diode General Purpose_2)
D6  Manufacturer P/N: SD103CWS-7-F  [SODFL250X110-2N]  (hidden comment: Diode General Purpose_2)
F3  3568  [Fuse Holder 30A 500V 1 Circuit Blade Through Hole]  (value not drawn)
F4  3568  [Fuse Holder 30A 500V 1 Circuit Blade Through Hole]  (value not drawn)
F5  3568  [Fuse Holder 30A 500V 1 Circuit Blade Through Hole]  (value not drawn)
F6  3568  [Fuse Holder 30A 500V 1 Circuit Blade Through Hole]  (value not drawn)
F7  3568  [Fuse Holder 30A 500V 1 Circuit Blade Through Hole]  (value not drawn)
F8  3568  [Fuse Holder 30A 500V 1 Circuit Blade Through Hole]  (value not drawn)
F9  3568  [Fuse Holder 30A 500V 1 Circuit Blade Through Hole]  (value not drawn)
F10  3568  [Fuse Holder 30A 500V 1 Circuit Blade Through Hole]  (value not drawn)
K3  1393277-8  [RELAY AUTOMOTIVE SPDT 45A 24V - duplicate]
K4  1393277-8  [RELAY AUTOMOTIVE SPDT 45A 24V - duplicate]
K5  1393277-8  [RELAY AUTOMOTIVE SPDT 45A 24V - duplicate]
K6  1393277-8  [RELAY AUTOMOTIVE SPDT 45A 24V - duplicate]
P3  0431605302  [CONN HDR 2POS 7.50MM]
P4  0431605302  [CONN HDR 2POS 7.50MM]
P5  0431605302  [CONN HDR 2POS 7.50MM]
P6  0431605302  [CONN HDR 2POS 7.50MM]
P7  0431605302  [CONN HDR 2POS 7.50MM]
Q3  N-MOS  Manufacturer P/N: NTD3055L104T4G  [DPAK228P991X238-3N]
Q4  N-MOS  Manufacturer P/N: NTD3055L104T4G  [DPAK228P991X238-3N]
Q5  N-MOS  Manufacturer P/N: NTD3055L104T4G  [DPAK228P991X238-3N]
Q6  N-MOS  Manufacturer P/N: NTD3055L104T4G  [DPAK228P991X238-3N]
R31  10k  [SMD-0805-RES]
R32  10k  [SMD-0805-RES]
R33  10k  [SMD-0805-RES]
R34  10k  [SMD-0805-RES]
TP5  TP  [Test Point]  (value not drawn)
TP6  TP  [Test Point]  (value not drawn)

### Nets
GND: P6.2 P7.2 Q3.3(S) Q4.3(S) Q5.3(S) Q6.3(S) R31.1 R32.1 R33.1 R34.1
V-BUS_FILT: D3.2(K) D4.2(K) D5.2(K) D6.2(K) K3.1 K4.1 K5.1 K6.1  [project net MSTR_SW +]
VPOS-24V_RAW: P3.1
BATT0_DISABLE: Q4.1(G) R32.2
BATT1_DISABLE: Q3.1(G) R31.2
BATT2_DISABLE: Q5.1(G) R33.2
BATT3_DISABLE: Q6.1(G) R34.2
VBATT-1S: F7.2 F8.2 K5.3 K6.3 P4.2 P5.2 TP6.1
NetD3_1: D3.1(A) K3.2 Q3.4(D)
NetD4_1: D4.1(A) K4.2 Q4.4(D)
NetD5_1: D5.1(A) K5.2 Q5.4(D)
NetD6_1: D6.1(A) K6.2 Q6.4(D)
NetF3_1: F3.1 F5.2 K3.4
NetF3_2: F3.2 F4.2 K3.3 K4.3 P3.2 TP5.1
NetF4_1: F4.1 F6.2 K4.4
NetF5_1: F5.1 P4.1
NetF6_1: F6.1 P5.1
NetF7_1: F7.1 F9.2 K5.4
NetF8_1: F8.1 F10.2 K6.4
NetF9_1: F9.1 P6.1
NetF10_1: F10.1 P7.1

Not connected (* = marked no-connect by the designer): K3 5*; K4 5*; K5 5*; K6 5*

### Notes on the sheet
- LV Battery Interface
- (near P3) LV PWR Switch
- Title
- Size:
- Date:
- A4
- Number:
- Time:
- Revision:
- Sheet
- of
- File:

### Library data of the parts
D3-D6 = Diode General Purpose_2: DIODE GEN PURP 20V 350MA SOD323; Manufacturer: Diodes Incorporated; Digikey P/N: SD103CWS-FDIDKR-ND; Package / Case: SOD323; Do Not Populate: *; ComponentLink1Description: Digikey; ComponentLink1URL: https://www.digikey.com/product-detail/en/diodes-incorporated/SD103CWS-7-F/SD103CWS-FDIDKR-ND/1836772; ComponentLink2Description: Datasheet; ComponentLink2URL: https://www.diodes.com/assets/Datasheets/ds30101.pdf; ComponentLink3Description: Dimensions; ComponentLink3URL: https://www.diodes.com/assets/Package-Files/SOD323.pdf
F3-F10 = 3568: FUSE HOLDER MINI AUTO PC; Manufacturer: Keystone Electronics; Material: Brass,Tin,Nylon; Color: Black; Body Material: Nylon; Current Rating: 20A; Voltage Rating (AC): 500V; Number of Poles: 1; Illumination Type: Illuminated; Fuse Type: Automotive; Approvals: UL; Supplier 1: Digi-Key; Manufacturer Part Number: 3568; Stock 1: 0; Mount: PCB,Vertical; Contact Material: Brass,Tin; Contact Plating: Tin; Min Operating Temperature: -50°C; Max Operating Temperature: 145°C; Package Quantity: 1; Termination: PC Pin; Orientation: Vertical; Number of Circuits: 1; Voltage: 500V; Fuse Current: 20A; Length: 16mm; Depth: 6.73mm; Lead Free: Lead Free; REACH SVHC: No SVHC; Flammability Rating: UL94 V-0; ComponentLink1URL: http://www.keyelco.com/userAssets/file/M60-2p40.pdf?src-supplier=Future+Electronics; ComponentLink1Description: http://www.keyelco.com/userAssets/file/M60-2p40.pdf?src-supplier=Future+Electronics; ComponentLink2URL: https://www.alliedelec.com/m/d/15b4f09b8ba48c4b08efedd730709c21.pdf?src-supplier=Allied+Electronics; ComponentLink2Description: https://www.alliedelec.com/m/d/15b4f09b8ba48c4b08efedd730709c21.pdf?src-supplier=Allied+Electronics; Supplier Part Number 1: 3568K-ND
  F3 F4 F7 F8: DNP: DNP
K3-K6 = 1393277-8: RELAY AUTOMOTIVE SPDT 45A 24V; Manufacturer: TE Connectivity; Coil Current: 66.29mA; Coil Resistance: 362R; Coil Power: 1.6W; Operate Time: 5ms; Number of Contacts: 2; Release Time: 3ms; Coil Type: Non-Latching; Supplier 1: Digi-Key; Manufacturer Part Number: 1393277-8; Stock 1: 2937; Pricing 1: 1=5.39, 10=5.053, 25=4.4912, 50=4.2666, 100=4.042, 250=3.73328 (USD); Mount: Through Hole; Number of Pins: 7; Weight: 22g; Contact Material: Silver; Min Operating Temperature: -40°C; Max Operating Temperature: 105°C; Throw Configuration: SPDT; Coil Voltage (DC): 24V; Termination: PCB; Contact Current Rating: 45A; Current Rating: 45A; Packaging: Bulk; Package Quantity: 525; Relay Type: Relay; Length: 26.1mm; Height: 21.2mm; Depth: 21.1mm; Width: 21.1mm; Radiation Hardening: No; Lead Free: Lead Free; ELV: Compliant; ComponentLink1URL: https://www.verical.com/server-webapp/html/getDatasheet?partID=318318&src-supplier=Verical; ComponentLink1Description: https://www.verical.com/server-webapp/html/getDatasheet?partID=318318&src-supplier=Verical; ComponentLink2URL: https://www.te.com/commerce/DocumentDelivery/DDEController?Action=srchrtrv&DocNm=V23133-X0000-A001&DocType=DS&DocLang=English&src-supplier=Digi-Key; ComponentLink2Description: https://www.te.com/commerce/DocumentDelivery/DDEController?Action=srchrtrv&DocNm=V23133-X0000-A001&DocType=DS&DocLang=English&src-supplier=Digi-Key; Supplier Part Number 1: PB1320-ND
P3-P7 = 0431605302: Conn Power HDR 2 POS 7.49mm Solder RA Thru-Hole 4 Terminal 1 Port Sabre™ Tray; Manufacturer: Molex; Current Rating: 18A; Number of Positions: 2; Voltage Rating: 600V; Number of Ports: 1; Contact Resistance: 30mR; Supplier 1: Digi-Key; Manufacturer Part Number: 0431605302; Stock 1: 0; Mount: Through Hole; Housing Material: Nylon; Contact Material: Brass; Contact Plating: Tin,Copper; Color: Black; Insulation Material: Nylon; Number of Terminals: 4; Housing Color: Black; Min Operating Temperature: -40°C; Max Operating Temperature: 75°C; Number of Rows: 1; Packaging: Tray; Package Quantity: 525; Termination: Solder; Number of Contacts: 2; Orientation: Right Angle; Fastening Type: Ramp; Length: 21.08mm; Pitch: 7.49mm; Depth: 19.79mm; ComponentLink1URL: https://www.verical.com/server-webapp/html/getDatasheet?partID=198412&src-supplier=Verical; ComponentLink1Description: https://www.verical.com/server-webapp/html/getDatasheet?partID=198412&src-supplier=Verical; ComponentLink2URL: http://components.arrow.com/part/dataview/2942820S6220968N3303?src-supplier=Arrow; ComponentLink2Description: http://components.arrow.com/part/dataview/2942820S6220968N3303?src-supplier=Arrow; ComponentLink3URL: http://www.molex.com/pdm_docs/ps/PSX-43335-9999.pdf?src-supplier=Digi-Key; ComponentLink3Description: http://www.molex.com/pdm_docs/ps/PSX-43335-9999.pdf?src-supplier=Digi-Key; Supplier Part Number 1: WM13983-ND
Q3-Q6 = N-MOS: N-Channel Power MOSFET, 12 A, 60 V; Manufacturer: ON SEMI; Digikey Link: https://www.digikey.com/product-detail/en/on-semiconductor/NTD3055L104T4G/NTD3055L104T4GOSDKR-ND/1749196; Digikey P/N: NTD3055L104T4GOSDKR-ND
R31-R34 = ERJ-P06J103V: as R1-R5 on sheet adc; Part Number: ERJ-P06J103V; Datasheets: https://industrial.panasonic.com/cdbs/www-data/pdf/RDA0000/AOA0000C243.pdf; Image: //media.digikey.com/Renders/Panasonic%20Renders/ERJ-0805%20Pkg.jpg; Digi-Key Part Number: P10KADCT-ND; Quantity Available: 413576; Packaging: Cut Tape (CT); Series: ERJ; Part Status: Active; Value: 10k; Tolerance: ±5%; Composition: Thick Film; Features: Automotive AEC-Q200, Pulse Withstanding; Operating Temperature: -55°C ~ 155°C; Package / Case: 0805 (2012 Metric); Supplier Device Package: 0805; Size / Dimension: 0.079" L x 0.049" W (2.00mm x 1.25mm); Height - Seated (Max): 0.028" (0.70mm); Number of Terminations: 2; Failure Rate: -
TP5 TP6 = TP: SMD TEST POINT